# Altium schematic sheet BOC_RS232.SchDoc: Board-On-Chip RS232 Serial Interface
size A; Organization: Altium Limited; Address1: L3, 12a Rodborough Rd; Address2: Frenchs Forest; Address3: NSW; Address4: Australia 2086; Revision: 1.06; SheetNumber: 12; SheetTotal: 16
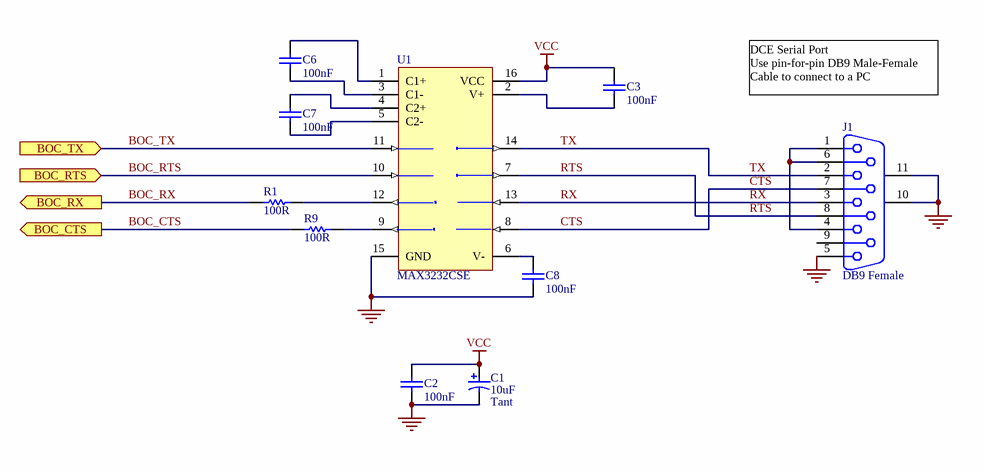
[diagram p0: BOC_RS232.SchDoc]

## Parts
C1  10uF  Capacitor Type: Tant  [MCCT-B]
C2  100nF  [CC2012-0805]
C3  100nF  [CC2012-0805]
C6  100nF  [CC2012-0805]
C7  100nF  [CC2012-0805]
C8  100nF  [CC2012-0805]
J1  DB9 Female  [DSUB1.385-2H9]
R1  100R  [CC2012-0805]
R9  100R  [CC2012-0805]
U1  MAX3232CSE  [SO-G16]

## Ports
BOC_CTS (out), BOC_RTS (in), BOC_RX (out), BOC_TX (in)

## Nets
GND: C1.2 C2.2 C8.2 J1.5 J1.10(MH1) J1.11(MH2) U1.15(GND)
VCC: C1.1 C2.1 C3.1 U1.16(VCC)
BOC_CTS: R9.1 ; port BOC_CTS
BOC_RTS: U1.10(T2IN) ; port BOC_RTS
BOC_RX: R1.1 ; port BOC_RX
BOC_TX: U1.11(T1IN) ; port BOC_TX
CTS: J1.7 U1.8(R2IN)
RTS: J1.8 U1.7(T2OUT)
RX: J1.3 U1.13(R1IN)
TX: J1.2 U1.14(T1OUT)
NetC3_2: C3.2 U1.2(V+)
NetC6_1: C6.1 U1.1(C1+)
NetC6_2: C6.2 U1.3(C1-)
NetC7_1: C7.1 U1.4(C2+)
NetC7_2: C7.2 U1.5(C2-)
NetC8_1: C8.1 U1.6(V-)
NetJ1_1: J1.1 J1.4 J1.6
NetR1_2: R1.2 U1.12(R1OUT)
NetR9_2: R9.2 U1.9(R2OUT)

Not connected (* = marked no-connect by the designer): J1 9

## Notes on the sheet
- DCE Serial Port
  Use pin-for-pin DB9 Male-Female
  Cable to connect to a PC
- Title
- Size:
- Date:
- A
- Number:
- Time:
- Revision:
- Sheet
- of
- File:

## Library data of the parts
C1 = CAP_POLAR: Polar Capacitor; Fitted: True
C2 C3 C6-C8 = CAP: Capacitor; Fitted: True
J1 = D Connector 9: Receptacle Assembly, 9 Position, Right Angle; Manufacturer: Generic Components; Package Information: Latest Revision: O; Positions: 9; Fitted: True; Published: 15-Jun-2001; Revision: July-2002: Re-released for DXP Platform.; Datasheet: (1-Sep-1999); Package Reference: 788750; Publisher: Altium Limited; Class I: Connector; Orientation: Right Angle; Gender: Receptacle
R1 R9 = RES: Resistor; Fitted: True
U1 = MAX3232EUE: 3.0V TO 5.5V, Low-Power, up to 1Mbps, True RS-232 Transceiver Using Four 0.1µF External Capacitor; Manufacturer: Maxim,ST; Package Information: Latest Revision: 21-0066 C; Class I: Communication; Published: 16-Jan-2001; Revision: July-2002: Re-released for DXP Platform.; Datasheet: Latest Revision: Mar-1999; Package Reference: TSSOP16; Publisher: Altium Limited; Class II: Transceiver; Fitted: True